# EAGLE schematic e1_phy_v7 (EAGLE 7.7.0)
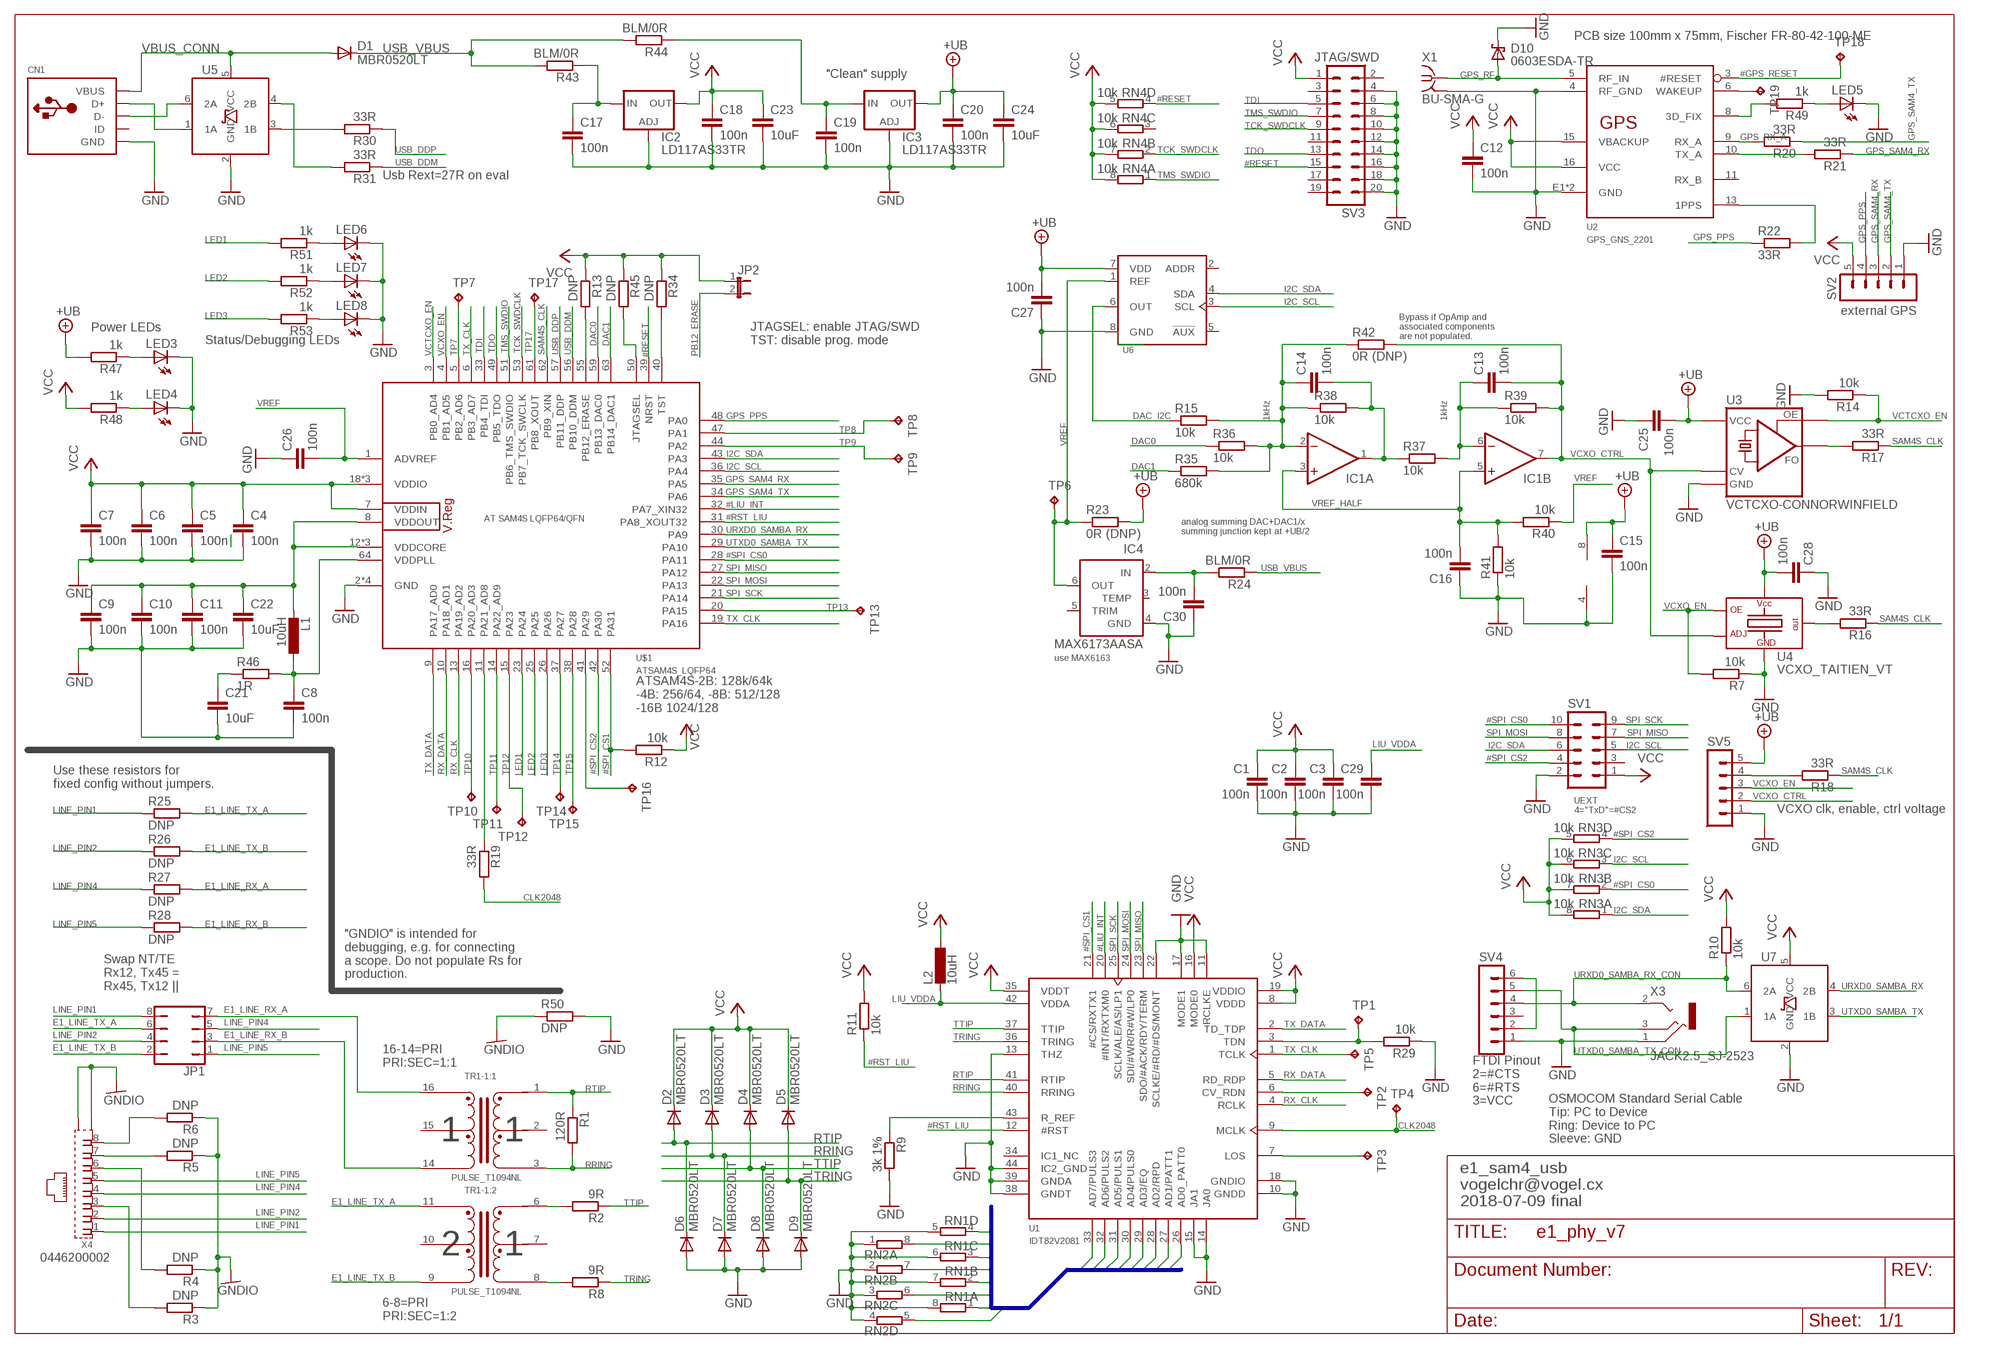
[diagram p0: schematic, sheet 1]

## Parts
C1  100n  C-EUC0603  [C0603]
C2  100n  C-EUC0603  [C0603]
C3  100n  C-EUC0603  [C0603]
C4  100n  C-EUC0603  [C0603]
C5  100n  C-EUC0603  [C0603]
C6  100n  C-EUC0603  [C0603]
C7  100n  C-EUC0603  [C0603]
C8  100n  C-EUC0603  [C0603]
C9  100n  C-EUC0603  [C0603]
C10  100n  C-EUC0603  [C0603]
C11  100n  C-EUC0603  [C0603]
C12  100n  C-EUC0603  [C0603]
C13  100n  C-EUC0603  [C0603]
C14  100n  C-EUC0603  [C0603]
C15  100n  C-EUC0603  [C0603]
C16  100n  C-EUC0603  [C0603]
C17  100n  C-EUC0603  [C0603]
C18  100n  C-EUC0603  [C0603]
C19  100n  C-EUC0603  [C0603]
C20  100n  C-EUC0603  [C0603]
C21  10uF  C-EUC0603  [C0603]
C22  10uF  C-EUC0603  [C0603]
C23  10uF  C-EUC0603  [C0603]
C24  10uF  C-EUC0603  [C0603]
C25  100n  C-EUC0603  [C0603]
C26  100n  C-EUC0603  [C0603]
C27  100n  C-EUC0603  [C0603]
C28  100n  C-EUC0603  [C0603]
C29  100n  C-EUC0603  [C0603]
C30  100n  C-EUC0603  [C0603]
CN1  USBMINIB  [USB-MINIB]
D1  MBR0520LT  [SOD123]
D2  MBR0520LT  [SOD123]
D3  MBR0520LT  [SOD123]
D4  MBR0520LT  [SOD123]
D5  MBR0520LT  [SOD123]
D6  MBR0520LT  [SOD123]
D7  MBR0520LT  [SOD123]
D8  MBR0520LT  [SOD123]
D9  MBR0520LT  [SOD123]
D10  0603ESDA-TR  [0603]
IC1  2AMP_P8+4D  [SO08]
IC2  LD117AS33TR  [SOT223]
IC3  LD117AS33TR  [SOT223]
IC4  MAX6173AASA  [SO08]
JP1  JP4Q  [JP4Q]
JP2  JP1E  [JP1]
L1  10uH  L-EUL1812  [L1812]
L2  10uH  L-EUL1812  [L1812]
LED3  LEDCHIPLED_0603  [CHIPLED_0603]
LED4  LEDCHIPLED_0603  [CHIPLED_0603]
LED5  LEDCHIPLED_0603  [CHIPLED_0603]
LED6  LEDCHIPLED_0603  [CHIPLED_0603]
LED7  LEDCHIPLED_0603  [CHIPLED_0603]
LED8  LEDCHIPLED_0603  [CHIPLED_0603]
R1  120R  R-EU_R0603  [R0603]
R2  9R  R-EU_R0603  [R0603]
R3  DNP  R-EU_R0603  [R0603]
R4  DNP  R-EU_R0603  [R0603]
R5  DNP  R-EU_R0603  [R0603]
R6  DNP  R-EU_R0603  [R0603]
R7  10k  R-EU_R0603  [R0603]
R8  9R  R-EU_R0603  [R0603]
R9  3k 1%  R-EU_R0603  [R0603]
R10  10k  R-EU_R0603  [R0603]
R11  10k  R-EU_R0603  [R0603]
R12  10k  R-EU_R0603  [R0603]
R13  DNP  R-EU_R0603  [R0603]
R14  10k  R-EU_R0603  [R0603]
R15  10k  R-EU_R0603  [R0603]
R16  33R  R-EU_R0603  [R0603]
R17  33R  R-EU_R0603  [R0603]
R18  33R  R-EU_R0603  [R0603]
R19  33R  R-EU_R0603  [R0603]
R20  33R  R-EU_R0603  [R0603]
R21  33R  R-EU_R0603  [R0603]
R22  33R  R-EU_R0603  [R0603]
R23  0R (DNP)  R-EU_R0603  [R0603]
R24  BLM/0R  R-EU_R0603  [R0603]
R25  DNP  R-EU_R0603  [R0603]
R26  DNP  R-EU_R0603  [R0603]
R27  DNP  R-EU_R0603  [R0603]
R28  DNP  R-EU_R0603  [R0603]
R29  10k  R-EU_R0603  [R0603]
R30  33R  R-EU_R0603  [R0603]
R31  33R  R-EU_R0603  [R0603]
R34  DNP  R-EU_R0603  [R0603]
R35  680k  R-EU_R0603  [R0603]
R36  10k  R-EU_R0603  [R0603]
R37  10k  R-EU_R0603  [R0603]
R38  10k  R-EU_R0603  [R0603]
R39  10k  R-EU_R0603  [R0603]
R40  10k  R-EU_R0603  [R0603]
R41  10k  R-EU_R0603  [R0603]
R42  0R (DNP)  R-EU_R0603  [R0603]
R43  BLM/0R  R-EU_R0603  [R0603]
R44  BLM/0R  R-EU_R0603  [R0603]
R45  DNP  R-EU_R0603  [R0603]
R46  1R  R-EU_R0603  [R0603]
R47  1k  R-EU_R0603  [R0603]
R48  1k  R-EU_R0603  [R0603]
R49  1k  R-EU_R0603  [R0603]
R50  DNP  R-EU_R0603  [R0603]
R51  1k  R-EU_R0603  [R0603]
R52  1k  R-EU_R0603  [R0603]
R53  1k  R-EU_R0603  [R0603]
RN1  4R-NEXB38V  [EXB38V]
RN2  4R-NEXB38V  [EXB38V]
RN3  10k  4R-NEXB38V  [EXB38V]
RN4  10k  4R-NEXB38V  [EXB38V]
SV1  MA05-2  [MA05-2]
SV2  MA05-1  [MA05-1]
SV3  MA10-2  [MA10-2]
SV4  MA06-1  [MA06-1]
SV5  MA05-1  [MA05-1]
TP1  TPB1,27  [B1,27]
TP2  TPB1,27  [B1,27]
TP3  TPB1,27  [B1,27]
TP4  TPB1,27  [B1,27]
TP5  TPB1,27  [B1,27]
TP6  TPB1,27  [B1,27]
TP7  TPB1,27  [B1,27]
TP8  TPB1,27  [B1,27]
TP9  TPB1,27  [B1,27]
TP10  TPB1,27  [B1,27]
TP11  TPB1,27  [B1,27]
TP12  TPB1,27  [B1,27]
TP13  TPB1,27  [B1,27]
TP14  TPB1,27  [B1,27]
TP15  TPB1,27  [B1,27]
TP16  TPB1,27  [B1,27]
TP17  TPB1,27  [B1,27]
TP18  TPB1,27  [B1,27]
TP19  TPB1,27  [B1,27]
TR1  PULSE_T1094NL  [PULSE_BH]
U1  IDT82V2081  [TQFP44]
U2  GPS_GNS_2201  [GPS_GNS_2201]
U3  VCTCXO-CONNORWINFIELD  [VCTCXO-CONNORWINFIELD]
U4  VCXO_TAITIEN_VT  [VCXO_TAITIEN_VT_7MM_5MM]
U5  IP4234CZ6  [TSOP-6]
U6  MAX521X  [UMAX8]
U7  IP4234CZ6  [TSOP-6]
U$1  ATSAM4S_LQFP64  [LQFP-ST-64-2]
X1  BU-SMA-G  [BU-SMA-G]
X3  JACK2.5_SJ-2523  [JACK2.5_SJ-2523]
X4  0446200002  [0446200002]

## Nets
#GPS_RESET: TP18.TP U2.3(#RESET)
#LIU_INT: U1.20(#INT/RXTXM0) U$1.32(PA7_XIN32)
#RESET: RN4.4 SV3.15 U$1.39(NRST)
#RST_LIU: R11.1 U1.12(#RST) U$1.31(PA8_XOUT32)
#SPI_CS0: RN3.2 SV1.10 U$1.28(PA11)
#SPI_CS1: R12.2 U1.21(#CS/RXTX1) U$1.52(PA31)
#SPI_CS2: RN3.4 SV1.4 U$1.42(PA30)
+UB: C15.1 C20.1 C24.1 C25.2 C27.2 C28.2 IC1.8(P:V+) IC3.4(OUT) R23.2 R47.2 SV5.5 U3.9(VCC) U4.6(VCC) U6.7(VDD)
AD0: RN2.8 U1.26(AD0_PATT0)
AD1: RN2.7 U1.27(AD1/PATT1)
AD2: RN2.6 U1.28(AD2/RPD)
AD3: RN2.5 U1.29(AD3/EQ)
AD4: RN1.4 U1.30(AD4/PULS0)
AD5: RN1.3 U1.31(AD5/PULS1)
AD6: RN1.2 U1.32(AD6/PULS2)
AD7: RN1.1 U1.33(AD7/PULS3)
CLK2048: R19.2 TP4.TP U1.9(MCLK)
CLK2048_SAM4S: R19.1 U$1.11(PA21_AD8)
DAC0: R36.1 U$1.59(PB13_DAC0)
DAC1: R35.1 U$1.63(PB14_DAC1)
DAC_I2C: R15.1 U6.6(OUT)
E1_LINE_RX_A: JP1.7 R27.2 TR1.16
E1_LINE_RX_B: JP1.3 R28.2 TR1.14
E1_LINE_TX_A: JP1.6 R25.2 TR1.11
E1_LINE_TX_B: JP1.2 R26.2 TR1.9
GND: C1.2 C2.2 C3.2 C4.2 C5.2 C6.2 C7.2 C8.2 C9.2 C10.2 C11.2 C12.2 C15.2 C16.1 C17.2 C18.2 C19.2 C20.2 C21.2 C22.2 C23.2 C24.2 C25.1 C26.1 C27.1 C28.1 C29.2 C30.1 CN1.GND D6.A D7.A D8.A D9.A D10.2(K) IC1.4(P:V-) IC2.1(ADJ) IC3.1(ADJ) IC4.4(GND) LED3.C LED4.C LED5.C LED6.C LED7.C LED8.C R7.1 R9.2 R14.2 R29.1 R41.1 R50.2 RN1.5 RN1.6 RN1.7 RN1.8 RN2.1 RN2.2 RN2.3 RN2.4 SV1.2 SV2.1 SV3.4 SV3.6 SV3.8 SV3.10 SV3.12 SV3.14 SV3.16 SV3.18 SV3.20 SV4.1 SV5.1 U1.10(GNDD) U1.11(RCLKE) U1.13(THZ) U1.14(JA0) U1.15(JA1) U1.17(MODE1) U1.18(GNDIO) U1.22(SCLKE/#RD/#DS/MONT) U1.38(GNDT) U1.39(GNDA) U1.44(IC2_GND) U2.4(RF_GND) U2.E1(GND) U2.E2(GND) U3.4(GND) U4.3(GND) U5.2(GND) U6.8(GND) U7.2(GND) U$1.2(GND) U$1.17(GND) U$1.46(GND) U$1.60(GND) X1.2 X1.3 X1.4 X1.5 X3.1(RING)
GNDIO: R3.1 R4.1 R5.1 R6.1 R50.1 X4.S@1(S1) X4.S@2(S2)
GPS_3DFIX: R49.2 U2.8(3D_FIX)
GPS_PPS: R22.1 SV2.4 U$1.48(PA0)
GPS_RF: D10.1(A) U2.5(RF_IN) X1.1
GPS_RX_A: R20.2 U2.9(RX_A)
GPS_SAM4_RX: R21.1 SV2.3 U$1.35(PA5)
GPS_SAM4_TX: R20.1 SV2.2 U$1.34(PA6)
GPS_WAKEUP: TP19.TP U2.6(WAKEUP)
I2C_SCL: RN3.3 SV1.5 U6.3(SCL) U$1.36(PA4)
I2C_SDA: RN3.1 SV1.6 U6.4(SDA) U$1.43(PA3)
JTAGSEL: R45.2 U$1.50(JTAGSEL)
LED1: R51.2 U$1.23(PA24)
LED2: R52.2 U$1.25(PA25)
LED3: R53.2 U$1.26(PA26)
LINE_PIN1: JP1.8 R25.1 X4.1
LINE_PIN2: JP1.4 R26.1 X4.2
LINE_PIN3: R3.2 X4.3
LINE_PIN4: JP1.5 R27.1 X4.4
LINE_PIN5: JP1.1 R28.1 X4.5
LINE_PIN6: R4.2 X4.6
LINE_PIN7: R5.2 X4.7
LINE_PIN8: R6.2 X4.8
LIU_VDDA: C29.1 L2.2 U1.42(VDDA)
N$1: CN1.D+ U5.1(1A)
N$2: CN1.D- U5.6(2A)
N$4: TP2.TP U1.6(CV_RDN)
N$5: R2.2 TR1.6
N$6: R29.2 TP1.TP U1.3(TDN)
N$8: TP3.TP U1.7(LOS)
N$9: C30.2 IC4.2(IN) R24.2
N$11: LED5.A R49.1
N$13: C19.1 IC3.3(IN) R44.1
N$14: C17.1 IC2.3(IN) R43.1
N$15: C21.1 R46.1
N$16: LED3.A R47.1
N$17: TP16.TP U$1.41(PA29)
N$18: LED4.A R48.1
N$25: R8.2 TR1.8
N$26: LED6.A R51.1
N$27: LED7.A R52.1
N$28: LED8.A R53.1
N$30: R22.2 U2.13(1PPS)
N$31: R9.1 U1.43(R_REF)
N$32: SV4.2 SV4.6
OPAMP1_IN_NEG: C14.1 IC1.2(A:-IN) R15.2 R35.2 R36.2 R38.1 R42.1
OPAMP1_OUT: C14.2 IC1.1(A:OUT) R37.1 R38.2
OPAMP2_IN_NEG: C13.1 IC1.6(B:-IN) R37.2 R39.1
PB12_ERASE: JP2.2 R13.2 U$1.55(PB12_ERASE)
RRING: D3.A D7.C R1.2 TR1.3 U1.40(RRING)
RTIP: D2.A D6.C R1.1 TR1.1 U1.41(RTIP)
RX_CLK: U1.4(RCLK) U$1.13(PA19_AD2)
RX_DATA: U1.5(RD_RDP) U$1.10(PA18_AD1)
SAM4S_CLK: R16.1 R17.1 R18.1 U$1.62(PB9_XIN)
SAM4S_CLK_EXT: R18.2 SV5.4
SAM4S_CLK_VCTXO: R17.2 U3.5(FO)
SAM4S_CLK_VCXO: R16.2 U4.4(Q)
SPI_MISO: SV1.7 U1.23(SDO/#ACK/RDY/TERM) U$1.27(PA12)
SPI_MOSI: SV1.8 U1.24(SDI/#WR/R#W/LP0) U$1.22(PA13)
SPI_SCK: SV1.9 U1.25(SCLK/ALE/AS/LP1) U$1.21(PA14)
TCK_SWDCLK: RN4.2 SV3.9 U$1.53(PB7_TCK_SWCLK)
TDI: SV3.5 U$1.33(PB4_TDI)
TDO: SV3.13 U$1.49(PB5_TDO)
TMS_SWDIO: RN4.1 SV3.7 U$1.51(PB6_TMS_SWDIO)
TP7: TP7.TP U$1.5(PB2_AD6)
TP8: TP8.TP U$1.47(PA1)
TP9: TP9.TP U$1.44(PA2)
TP10: TP10.TP U$1.16(PA20_AD3)
TP11: TP11.TP U$1.14(PA22_AD9)
TP12: TP12.TP U$1.15(PA23)
TP13: TP13.TP U$1.20(PA15)
TP14: TP14.TP U$1.37(PA27)
TP15: TP15.TP U$1.38(PA28)
TP17: TP17.TP U$1.61(PB8_XOUT)
TPS_TX_A: R21.2 U2.10(TX_A)
TRING: D5.A D9.C R8.1 U1.36(TRING)
TST: R34.2 U$1.40(TST)
TTIP: D4.A D8.C R2.1 U1.37(TTIP)
TX_CLK: TP5.TP U1.1(TCLK) U$1.6(PB3_AD7) U$1.19(PA16)
TX_DATA: U1.2(TD_TDP) U$1.9(PA17_AD0)
URXD0_SAMBA_RX: U7.4(2B) U$1.30(PA9)
URXD0_SAMBA_RX_CON: R10.1 SV4.4 U7.6(2A) X3.2(TIP)
USB_DDM: R31.1 U$1.56(PB10_DDM)
USB_DDM_CON: R31.2 U5.4(2B)
USB_DDP: R30.1 U$1.57(PB11_DDP)
USB_DDP_CON: R30.2 U5.3(1B)
USB_VBUS: D1.C R24.1 R43.2 R44.2
UTXD0_SAMBA_TX: U7.3(1B) U$1.29(PA10)
UTXD0_SAMBA_TX_CON: SV4.5 U7.1(1A) X3.3(MIDDLE)
VBUS_CONN: CN1.VBUS D1.A U5.5(VCC)
VCC: C1.1 C2.1 C3.1 C4.1 C5.1 C6.1 C7.1 C12.1 C18.1 C23.1 D2.C D3.C D4.C D5.C IC2.4(OUT) JP2.1 L2.1 R10.2 R11.2 R12.1 R13.1 R34.1 R45.1 R48.2 RN3.5 RN3.6 RN3.7 RN3.8 RN4.5 RN4.6 RN4.7 RN4.8 SV1.1 SV2.5 SV3.1 U1.8(VDDD) U1.16(MODE0) U1.19(VDDIO) U1.35(VDDT) U2.15(VBACKUP) U2.16(VCC) U7.5(VCC) U$1.7(VDDIN) U$1.18(VDDIO) U$1.45(VDDIO) U$1.58(VDDIO)
VCTCXO_EN: R14.1 U3.8(OE) U$1.3(PB0_AD4)
VCXO_CTRL: C13.2 IC1.7(B:OUT) R39.2 R42.2 SV5.2 U3.10(CV) U4.1(VADJ)
VCXO_EN: R7.2 SV5.3 U4.2(OE) U$1.4(PB1_AD5)
VDDCORE: C9.1 C10.1 C11.1 C22.1 L1.2 U$1.8(VDDOUT) U$1.12(VDDCORE) U$1.24(VDDCORE) U$1.54(VDDCORE)
VDDPLL: C8.1 L1.1 R46.2 U$1.64(VDDPLL)
VREF: C26.2 IC4.6(OUT) R23.1 R40.1 TP6.TP U6.1(REF) U$1.1(ADVREF)
VREF_HALF: C16.2 IC1.3(A:+IN) IC1.5(B:+IN) R40.2 R41.2
Unconnected: CN1.ID IC4.3(TEMP) IC4.5(TRIM) RN4.3 SV1.3 SV3.2 SV3.3 SV3.11 SV3.17 SV3.19 SV4.3 TR1.2 TR1.7 TR1.10 TR1.15 U1.34(IC1_NC) U2.11(RX_B) U6.2(ADDR) U6.5(!AUX)

## Buses
AD8:AD[0..7]

## Notes on the sheet
- PCB size 100mm x 75mm, Fischer FR-80-42-100-ME
- JTAG/SWD
- "Clean" supply
- Usb Rext=27R on eval
- external GPS
- Power LEDs
- Bypass if OpAmp and
  associated components
  are not populated.
- Status/Debugging LEDs
- JTAGSEL: enable JTAG/SWD
  TST: disable prog. mode
- 1kHz | 1kHz
- analog summing DAC+DAC1/x
  summing junction kept at +UB/2
- use MAX6163
- ATSAM4S-2B: 128k/64k
  -4B: 256/64, -8B: 512/128
  -16B 1024/128
- Use these resistors for
  fixed config without jumpers.
- UEXT
  4="TxD"=#CS2
- VCXO clk, enable, ctrl voltage
- "GNDIO" is intended for
  debugging, e.g. for connecting
  a scope. Do not populate Rs for
  production.
- Swap NT/TE
  Rx12, Tx45 =
  Rx45, Tx12 ||
- 16-14=PRI
  PRI:SEC=1:1
- FTDI Pinout
  2=#CTS
  6=#RTS
  3=VCC
- 1 | 1
- OSMOCOM Standard Serial Cable
  Tip: PC to Device
  Ring: Device to PC
  Sleeve: GND
- e1_sam4_usb
  vogelchr@vogel.cx
  2018-07-09 final
- 2 | 1
- 6-8=PRI
  PRI:SEC=1:2

## Library data of the parts
C1-C30 = rcl:C-EU: CAPACITOR, European symbol; SPICEPREFIX: C
CN1 = adafruit:USB: USB Connectors USBMINIB - Surface Mount Female Mini-B USB Connector 4UConnector: 06564 By microbuilder.eu Thru-hole RA Female Mini-B USB Connector 4UConnector: 18732 By ladyada.net
D1 = diode:MBR0520LT: SCHOTTKY BARRIER RECTIFIER Source: http://onsemi.com .. MBR0520LT1-D.pdf
D2-D9 = diode@1:MBR0520LT: SCHOTTKY BARRIER RECTIFIER Source: http://onsemi.com .. MBR0520LT1-D.pdf
D10 = laforge:0603ESDA-TR: Bussmann 0603ESDA-TR ESD Suppressor
IC1 = linear:2AMP_P8+4: OP AMP
IC2 IC3 = v-reg:LD117A?*: Low drop fixed and adjustable positive voltage regulators 1 A Source: http://www.st.com/stonline/products/literature/ds/7194/ld1117axx.pdf
IC4 = maxim:MAX617*ASA: High-Precision Voltage References with Temperature Sensor Source: http://datasheets.maxim-ic.com/en/ds/MAX6173-MAX6177.pdf; MPN: MAX6173AASA+; OC_FARNELL: unknown; OC_NEWARK: 61K0602
JP1 = jumper:JP4Q: JUMPER
JP2 = jumper@1:JP1E: JUMPER
L1 L2 = rcl:L-EU: INDUCTOR, European symbol; SPICEPREFIX: L
LED3-LED8 = led:LED: LED OSRAM: - CHIPLED LG R971, LG N971, LY N971, LG Q971, LY Q971, LO R971, LY R971 LH N974, LH R974 LS Q976, LO Q976, LY Q976 LO Q996 - Hyper CHIPLED LW Q18S LB Q993, LB Q99A, LB R99A - SideLED LS A670, LO A670, LY A670, LG A670, LP A670 LB A673, LV A673, LT A673, LW A673 LH A674 LY A675 LS A676, LA A676, LO A676, LY A676, LW A676 LS A679, LY A679, LG A679 - Hyper Micro SIDELED® LS Y876, LA Y876, LO Y876, LY Y876 LT Y87S - SmartLED LW L88C, LW L88S LB L89C, LB L89S, LG L890 LS L89K, LO L89K, LY L89K LS L896, LA L896, LO L896, LY L896 - TOPLED LS T670, LO T670, LY T670, LG T670, LP T670 LSG T670, LSP T670, LSY T670, LOP T670, LYG T670 LG T671, LOG T671, LSG T671 LB T673, LV T673, LT T673, LW T673 LH T674 LS T676, LA T676, LO T676, LY T676, LB T676, LH T676, LSB T676, LW T676 LB T67C, LV T67C, LT T67C, LS T67K, LO T67K, LY T67K, LW E67C LS E67B, LA E67B, LO E67B, LY E67B, LB E67C, LV E67C, LT E67C LW T67C LS T679, LY T679, LG T679 LS T770, LO T770, LY T770, LG T770, LP T770 LB T773, LV T773, LT T773, LW T773 LH T774 LS E675, LA E675, LY E675, LS T675 LS T776, LA T776, LO T776, LY T776, LB T776 LHGB T686 LT T68C, LB T68C - Hyper Mini TOPLED® LB M676 - Mini TOPLED Santana® LG M470 LS M47K, LO M47K, LY M47K Source: http://www.osram.convergy.de LUXEON: - LUMILED® LXK2-PW12-R00, LXK2-PW12-S00, LXK2-PW14-U00, LXK2-PW14-V00 LXK2-PM12-R00, LXK2-PM12-S00, LXK2-PM14-U00 LXK2-PE12-Q00, LXK2-PE12-R00, LXK2-PE12-S00, LXK2-PE14-T00, LXK2-PE14-U00 LXK2-PB12-K00, LXK2-PB12-L00, LXK2-PB12-M00, LXK2-PB14-N00, LXK2-PB14-P00, LXK2-PB14-Q00 LXK2-PR12-L00, LXK2-PR12-M00, LXK2-PR14-Q00, LXK2-PR14-R00 LXK2-PD12-Q00, LXK2-PD12-R00, LXK2-PD12-S00 LXK2-PH12-R00, LXK2-PH12-S00 LXK2-PL12-P00, LXK2-PL12-Q00, LXK2-PL12-R00 Source: www.luxeon.com KINGBRIGHT: KA-3528ASYC Source: www.kingbright.com
R1-R31 R34-R53 = rcl:R-EU_: RESISTOR, European symbol; SPICEPREFIX: R
RN1-RN4 = resistor-dil:4R-N: Array Chip Resistor Source: RS Component / Phycomp; OC_FARNELL: unknown; OC_NEWARK: unknown
SV1 = con-lstb@1:MA05-2: PIN HEADER; OC_FARNELL: unknown; OC_NEWARK: unknown
SV2 SV5 = con-lstb:MA05-1: PIN HEADER; OC_FARNELL: unknown; OC_NEWARK: unknown
SV3 = con-lstb@1:MA10-2: PIN HEADER; OC_FARNELL: unknown; OC_NEWARK: unknown
SV4 = con-lstb@1:MA06-1: PIN HEADER; OC_FARNELL: unknown; OC_NEWARK: unknown
TP1-TP19 = testpad:TP: Test pad
TR1 = laforge:PULSE_T1094NL
U1 = idt82v2081:IDT82V2081: Single Channel T1/T1/J1 Long Haul/Short Haul Line Interface Unit
U2 = cvogel:GPS_GNS_2201
U3 = Connor-Winfield_VCTCXO:VCTCXO-CONNORWINFIELD: Connor-Winfield T-Series TCXO / VCTCXO 10 pin
U4 = cvogel:VCXO_TAITIEN_VT
U5 U7 = laforge:IP4234CZ6: NXP IP4234CZ6 - Single USB 2.0 ESD protection to IEC 61000-4-2 level 4; OC_DIGIKEY: 568-5869-1-ND
U6 = max5215_max5217:MAX521X: MAX5215/MAX5217 14-/16-Bit, Low-Power, Buffered Output Rail-to-Rail DACs with I2C Interface
U$1 = cvogel:ATSAM4S_LQFP64
X1 = con-coax:BU-SMA-G: FEMALE SMA CONNECTOR Radiall distributor RS 193-9117; OC_FARNELL: unknown; OC_NEWARK: unknown
X3 = SJ-2523-JACK:JACK2.5_SJ-2523: CUI Inc. SJ-2523-SMT; OC_DIGIKEY: CP-2523SJCT-ND
X4 = con-molex:0446200002: RJ-45 INVERTED MODULAR JACK ASSEMBLY WITH RJ-11 KEEPOUT FEATURE Source: Data sheet <http://www.farnell.com/datasheets/73207.pdf> MOLEX 0446200002 BUCHSE, RJ45, GESCHIRMT Source: Farnell <http://de.farnell.com/molex/0446200002/buchse-rj45-geschirmt/dp/9251910?ost=9251910>; MF: MOLEX; MPN: 0446200002; OC_FARNELL: 9251910